# Altium schematic sheet Shutdown_2019_v1.1_Power.SchDoc: Shutdown_2019_v1.1
size 453 x 301 mm; Date: 1/4/2019 10:42:21 PM; SheetNumber: 6; GateName_1: G$1; SymbolName_1: FRAME_B_L; LibraryName: frames; DeviceSetName: FRAME_B_L; GateName_2: G$2; SymbolName_2: DOCFIELD
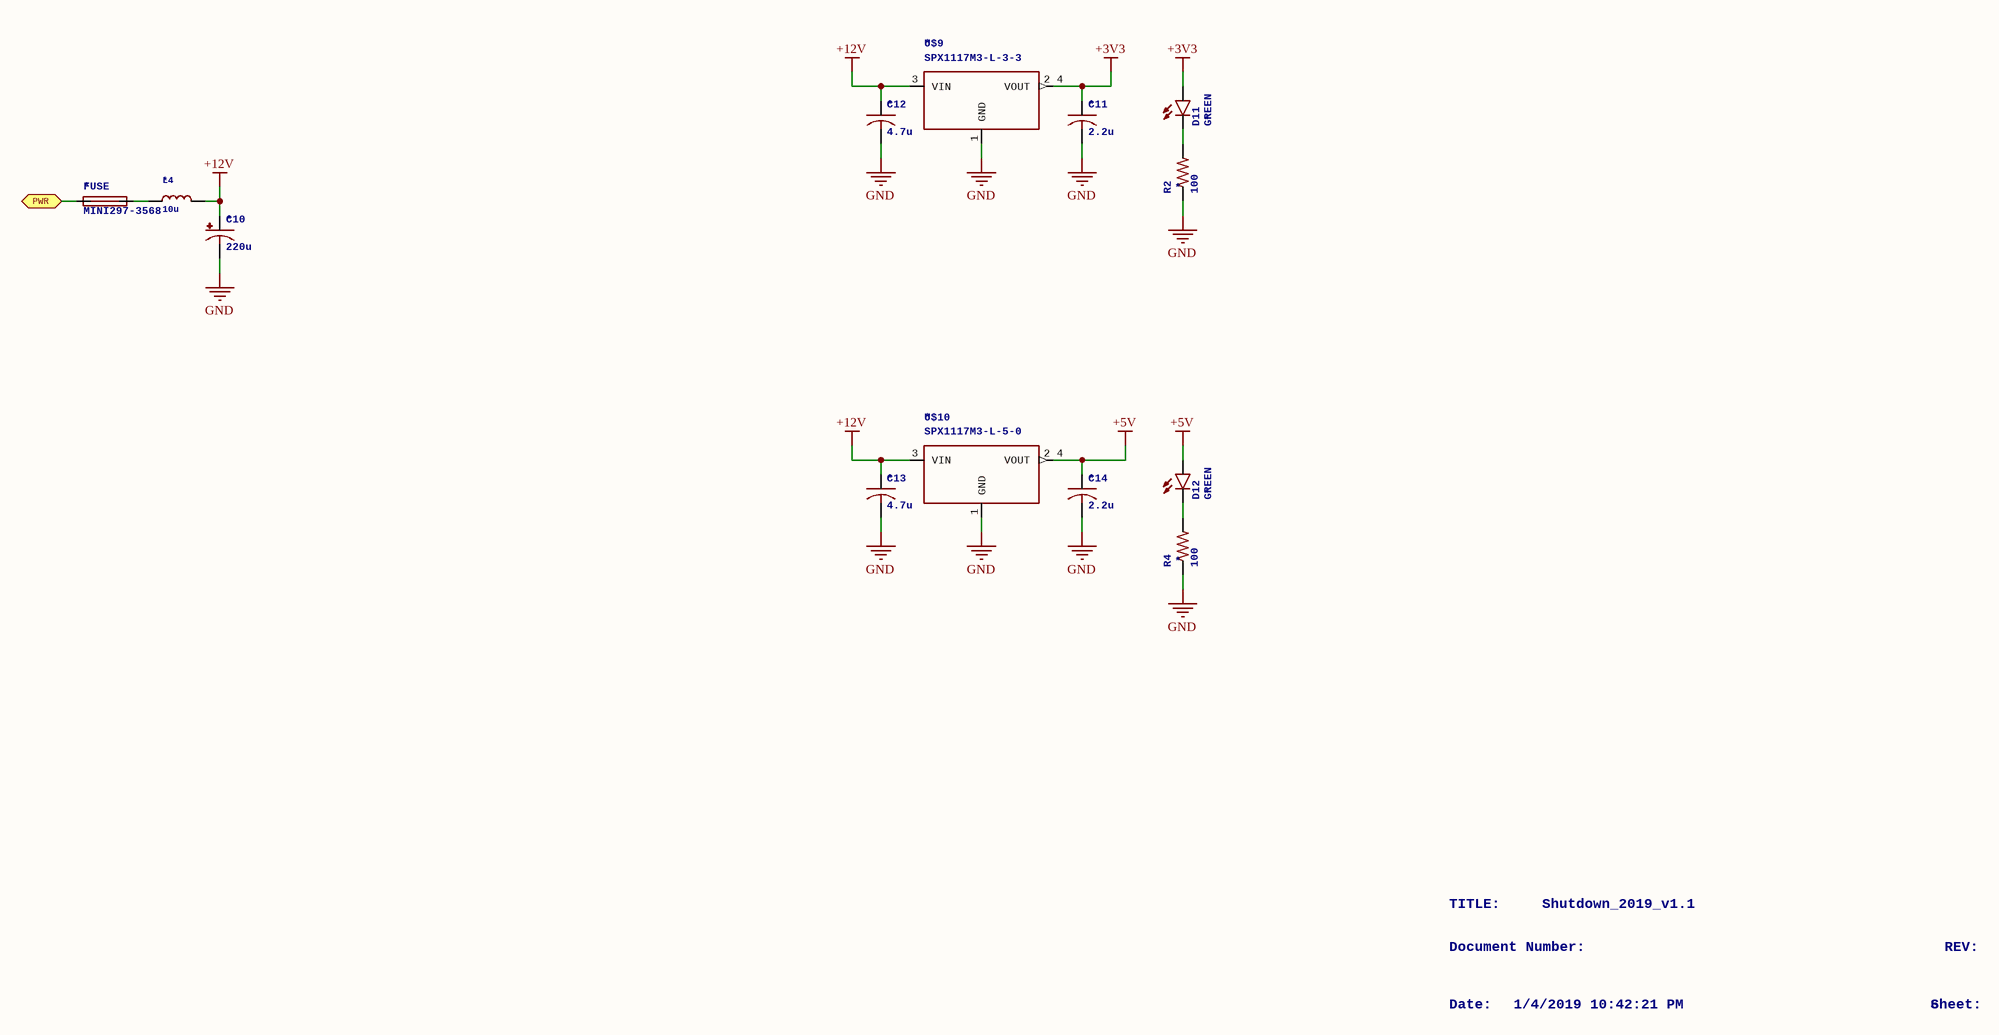
[diagram p0: Shutdown_2019_v1.1_Power.SchDoc]

## Parts
C10  220u  [E2,5-7]
C11  2.2u  [C0805]
C12  4.7u  [C0805]
C13  4.7u  [C0805]
C14  2.2u  [C0805]
D11  GREEN  [LED-0603]
D12  GREEN  [LED-0603]
FUSE  MINI297-3568  [3568]
L4  10u  [INDUCTOR_5X5MM_NR5040_NOTHERMALS]
R2  100  [R0603]
R4  100  [R0603]
U$9  SPX1117M3-L-3-3  [SOT223]
U$10  SPX1117M3-L-5-0  [SOT223]

## Ports
PWR

## Nets
+3V3: C11.1 D11.A U$9.2_4(VOUT)
+5V: C14.1 D12.A U$10.2_4(VOUT)
+12V: C10.+ C12.1 C13.1 L4.P$2 U$9.3(VIN) U$10.3(VIN)
GND: C10.- C11.2 C12.2 C13.2 C14.2 R2.1 R4.1 U$9.1(GND) U$10.1(GND)
PWR: FUSE.P$1_P$4 ; port PWR
NetD11_C: D11.C R2.2
NetD12_C: D12.C R4.2
NetFUSE_P$2 P$3: FUSE.P$2_P$3 L4.P$1

## Notes on the sheet
- TITLE:
- Document Number:
- Shutdown_2019_v1.1
- REV:
- Date:
- 1/4/2019 10:42:21 PM
- Sheet:
- 6
- 1
- 2
- 3
- 4
- 5
- 7
- 8
- 9
- A
- B
- C
- D
- E
- F

## Library data of the parts
C10 = CPOL-USE2.5-7: POLARIZED CAPACITOR, American symbol; GateName_1: G$1; DeviceName: E2.5-7; SymbolName_1: CPOL-US; LibraryName: rcl; DeviceSetName: CPOL-US; NAME: *; SPICEPREFIX: C
C11-C14 = C-USC0805: CAPACITOR, American symbol; GateName_1: G$1; SymbolName_1: C-US; DeviceName: C0805; LibraryName: rcl; DeviceSetName: C-US; NAME: *; SPICEPREFIX: C
D11 D12 = LED-GREEN0603: Various green LEDsGreen LEDs used in SFE Production0603- DIO-00821LARGE- DIO-00862LILYPAD- DIO-09910; GateName_1: G$1; SymbolName_1: LED; DeviceName: 0603; LibraryName: SparkFun-LED; DeviceSetName: LED-GREEN; NAME: *; PROD_ID: DIO-00821
FUSE = MINI297-3568: GateName_1: G$1; SymbolName_1: FUSE; LibraryName: Fuse; DeviceSetName: MINI297-3568; NAME: *
L4 = INDUCTORNR5040: Inductors0603:0805:1007 (2518 Metric) SMT:5.0x5.0mm (Taiyo Yuden NR5040 Series)5.0x5.0mm (TDK VLC5045 Series)6.0x6.0mm (TDK VLC6045 Series)6.0x6.0mm (TDK SLF6045 Series)6.0x6.0mm (Sumida CDRH5D28 Series)Taiyo Yuden NR3015T2R2M - 2.2uH 20% 1.5A (Digikey: 587-1648-2-ND, Mouser: 963-NR3015T2R2M) - Used with TI TPS62172CoilCraft RFID Transponder Coil - MA5532-AE (For use with AS3935 Lightning Sensor); GateName_1: G$1; SymbolName_1: INDUCTOR; DeviceName: NR5040; LibraryName: microbuilder; DeviceSetName: INDUCTOR; NAME: *
R2 R4 = R-US_R0603: RESISTOR, American symbol; GateName_1: G$1; SymbolName_1: R-US; DeviceSetName: R-US_; DeviceName: R0603; LibraryName: rcl; NAME: *; SPICEPREFIX: R
U$9 = SPX1117M3-L-3-3: SPX1117M3-L-3-3 3.3V 800mA LDOMaxLinear IncDatasheetDigikey; GateName_1: G$1; SymbolName_1: 3_TERMINAL_FIXED_LDO; LibraryName: MAXLINEAR; DeviceSetName: SPX1117M3-L-3-3; NAME: *
U$10 = SPX1117M3-L-5-0: SPX1117M3-L-5-0 5.0V 800mA LDOMaxLinear IncDatasheetDigikey; GateName_1: G$1; SymbolName_1: 3_TERMINAL_FIXED_LDO; LibraryName: MAXLINEAR; DeviceSetName: SPX1117M3-L-5-0; NAME: *